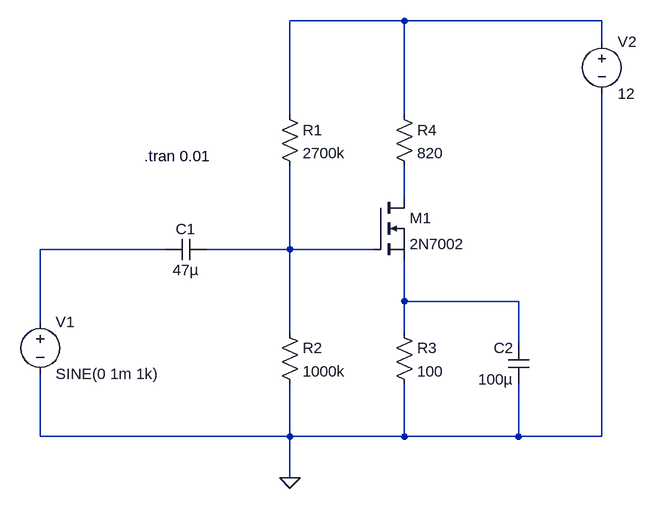
[diagram p0: schematic A02 - Simulacao.asc]
A02 - Simulacao.asc, the LTspice schematic file:
Version 4
SHEET 1 880 680
WIRE 224 -144 48 -144
WIRE 528 -144 224 -144
WIRE 528 -112 528 -144
WIRE 48 0 48 -144
WIRE 224 0 224 -144
WIRE 224 128 224 80
WIRE -144 208 -336 208
WIRE 48 208 48 80
WIRE 48 208 -80 208
WIRE 176 208 48 208
WIRE 224 288 224 224
WIRE 400 288 224 288
WIRE -336 320 -336 208
WIRE 48 336 48 208
WIRE 224 336 224 288
WIRE 400 352 400 288
WIRE -336 496 -336 400
WIRE 48 496 48 416
WIRE 48 496 -336 496
WIRE 224 496 224 416
WIRE 224 496 48 496
WIRE 400 496 400 416
WIRE 400 496 224 496
WIRE 528 496 528 -32
WIRE 528 496 400 496
WIRE 48 560 48 496
FLAG 48 560 0
SYMBOL nmos 176 128 R0
SYMATTR InstName M1
SYMATTR Value 2N7002
SYMBOL voltage -336 304 R0
WINDOW 123 0 0 Left 0
WINDOW 39 0 0 Left 0
SYMATTR InstName V1
SYMATTR Value SINE(0 1m 1k)
SYMBOL voltage 528 -128 R0
WINDOW 123 0 0 Left 0
WINDOW 39 0 0 Left 0
SYMATTR InstName V2
SYMATTR Value 12
SYMBOL cap -80 192 R90
WINDOW 0 0 32 VBottom 2
WINDOW 3 32 32 VTop 2
SYMATTR InstName C1
SYMATTR Value 47µ
SYMBOL cap 416 416 R180
WINDOW 0 24 56 Left 2
WINDOW 3 24 8 Left 2
SYMATTR InstName C2
SYMATTR Value 100µ
SYMBOL res 32 -16 R0
SYMATTR InstName R1
SYMATTR Value 2700k
SYMBOL res 32 320 R0
SYMATTR InstName R2
SYMATTR Value 1000k
SYMBOL res 208 320 R0
SYMATTR InstName R3
SYMATTR Value 100
SYMBOL res 208 -16 R0
SYMATTR InstName R4
SYMATTR Value 820
TEXT -176 64 Left 2 !.tran 0.01

The netlist it stands for:
* A02 - Simulacao.asc
M1 N002 N004 N005 N005 2N7002
V1 N003 0 SINE(0 1m 1k)
V2 N001 0 12
C1 N004 N003 47µ
C2 0 N005 100µ
R1 N001 N004 2700k
R2 N004 0 1000k
R3 N005 0 100
R4 N001 N002 820
.model NMOS NMOS
.model PMOS PMOS
.lib standard.mos
.tran 0.01
.backanno
.end